# Altium project VCO_MainBoard.PrjPcb
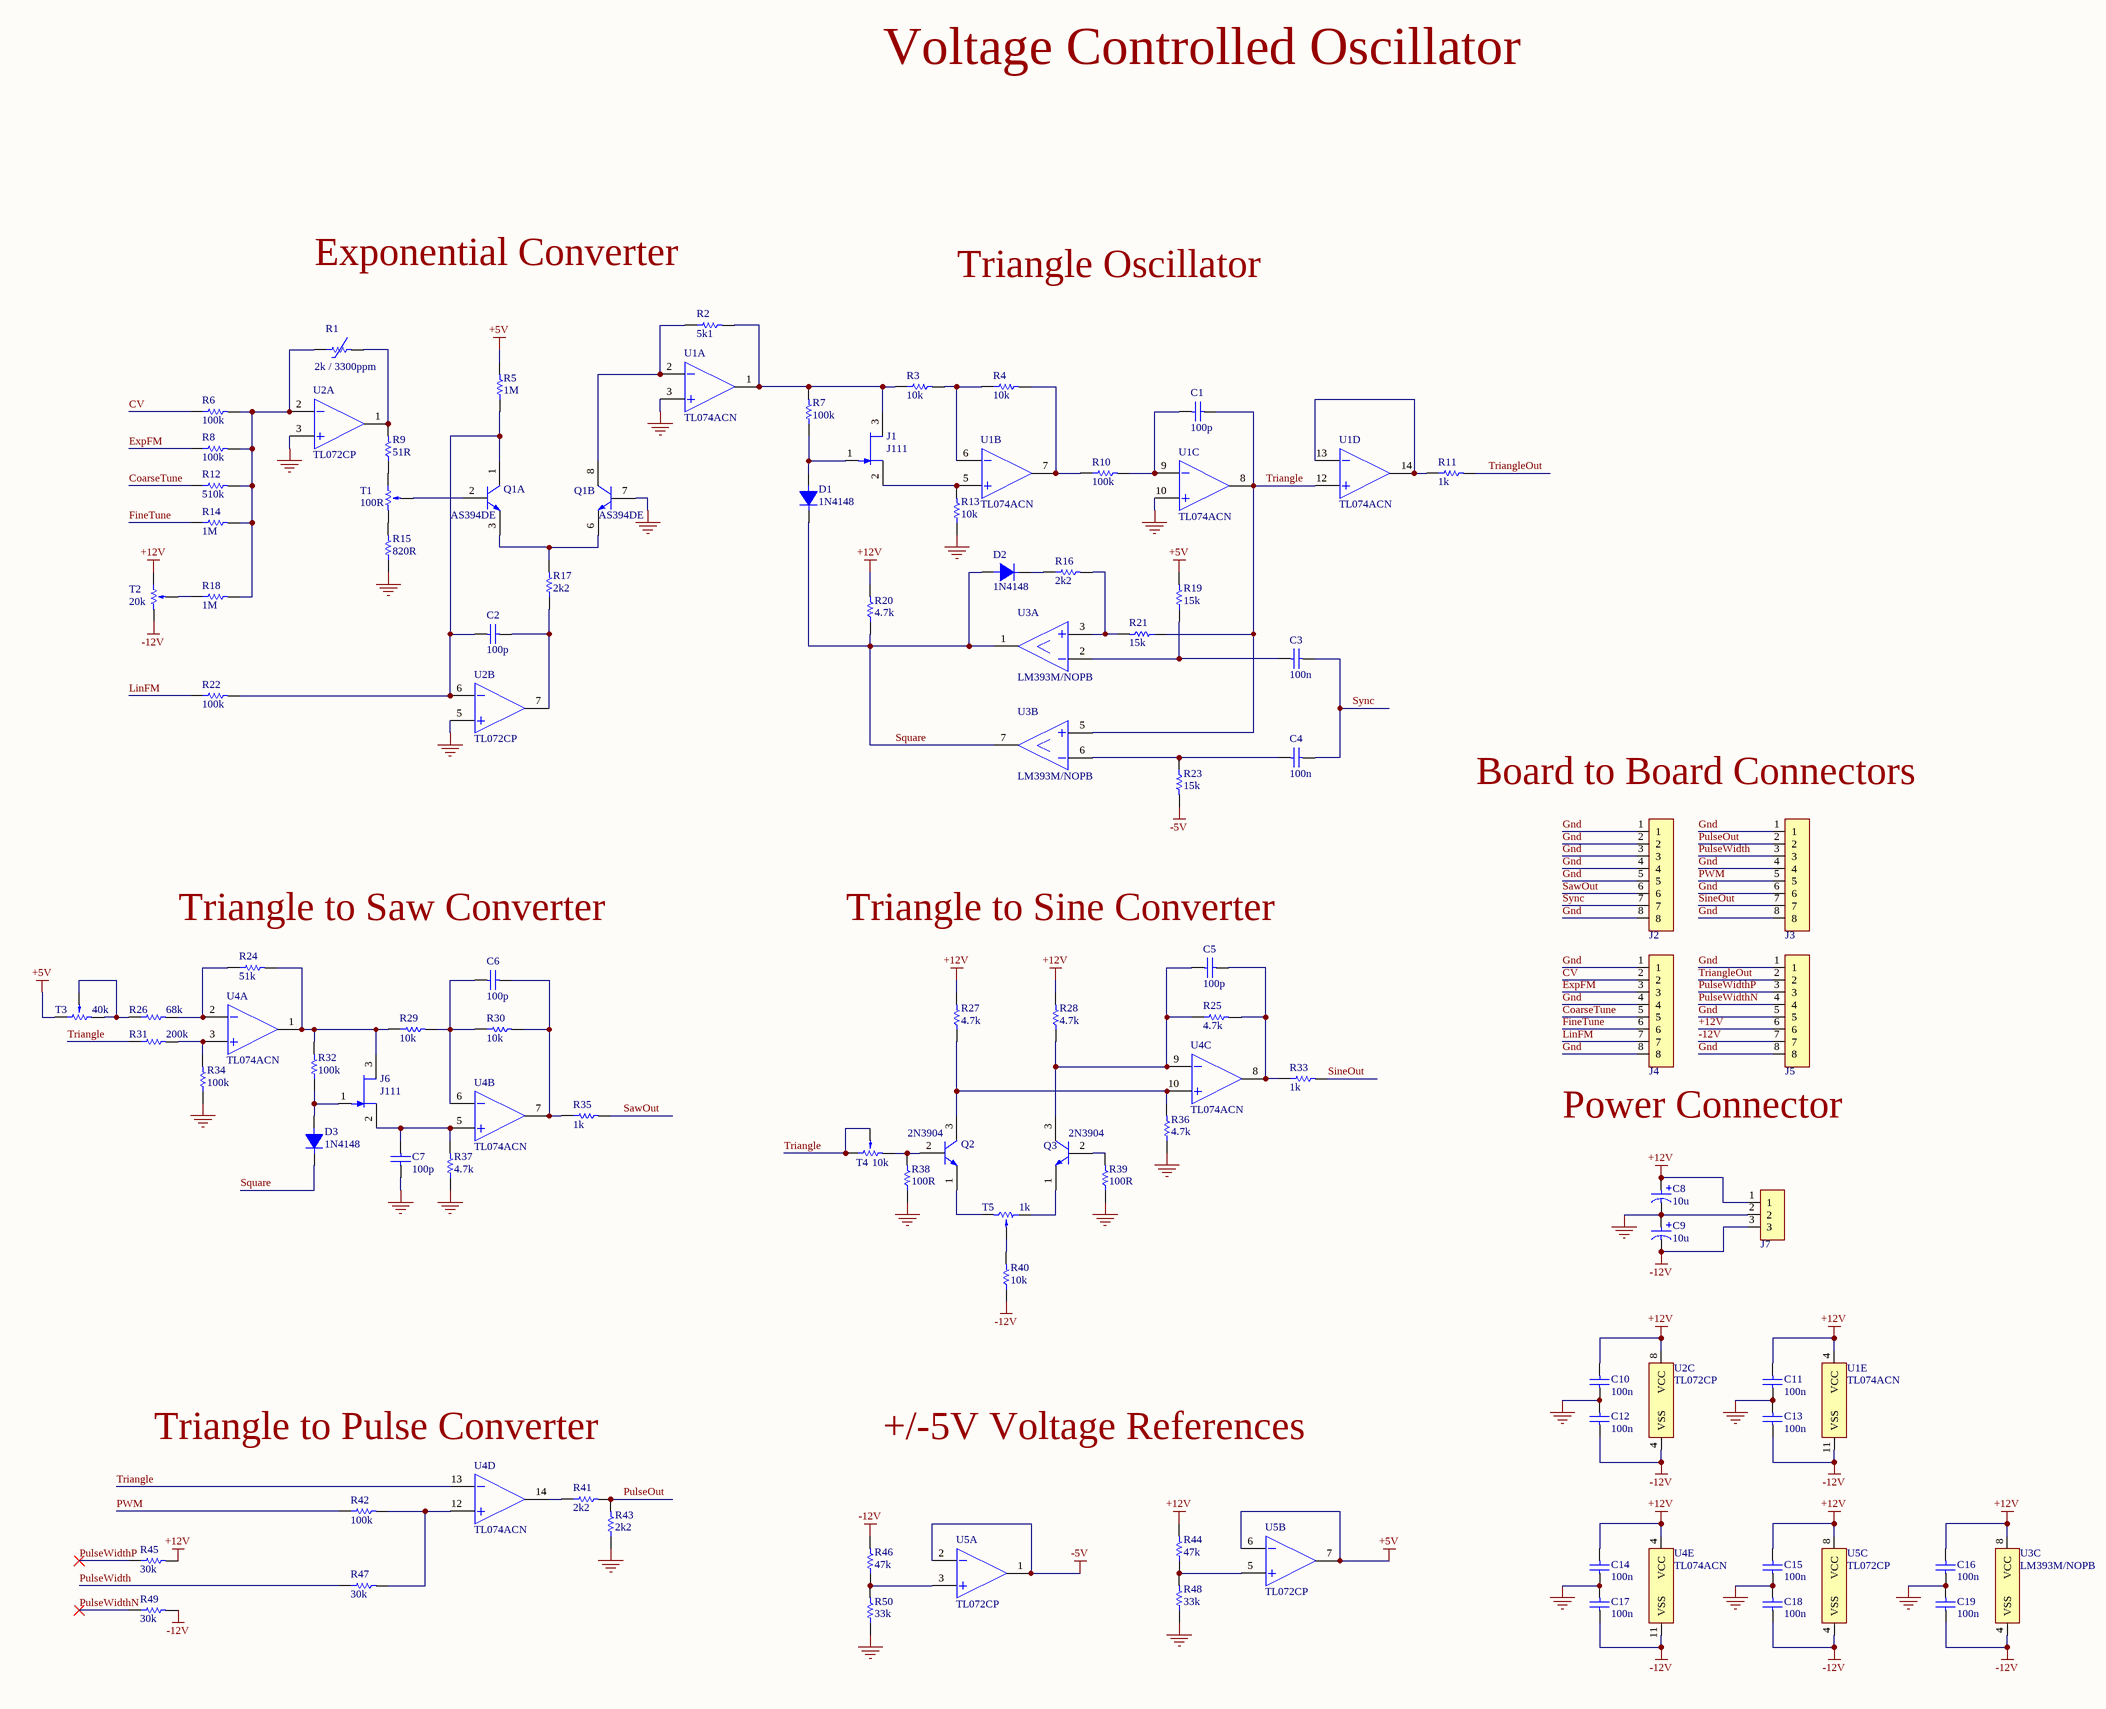
[diagram p0: VCO_MainBoard.SchDoc]
1 sheet, 92 parts. Net scope: global (net labels, ports and power ports of the same name join across sheets).
Board file: VCO_MainBoard.PcbDoc

## Sheet VCO_MainBoard.SchDoc: Voltage Controlled Oscillator - Main Board
size A2; Author: Laura Isabel Regan Williams; DrawnBy: Laura Regan Williams; SheetNumber: 1; SheetTotal: 1

### Parts
C1  100p  [CAP DISC 2.54MM PITCH 5.0 DIAMETER]
C2  100p  [CAP DISC 2.54MM PITCH 5.0 DIAMETER]
C3  100n  [CAP DISC 2.54MM PITCH 5.0 DIAMETER]
C4  100n  [CAP DISC 2.54MM PITCH 5.0 DIAMETER]
C5  100p  [CAP DISC 2.54MM PITCH 5.0 DIAMETER]
C6  100p  [CAP DISC 2.54MM PITCH 5.0 DIAMETER]
C7  100p  [CAP DISC 2.54MM PITCH 5.0 DIAMETER]
C8  10u  [CELEC_R_5x11_3]
C9  10u  [CELEC_R_5x11_3]
C10  100n  [CAP DISC 2.54MM PITCH 5.0 DIAMETER]
C11  100n  [CAP DISC 2.54MM PITCH 5.0 DIAMETER]
C12  100n  [CAP DISC 2.54MM PITCH 5.0 DIAMETER]
C13  100n  [CAP DISC 2.54MM PITCH 5.0 DIAMETER]
C14  100n  [CAP DISC 2.54MM PITCH 5.0 DIAMETER]
C15  100n  [CAP DISC 2.54MM PITCH 5.0 DIAMETER]
C16  100n  [CAP DISC 2.54MM PITCH 5.0 DIAMETER]
C17  100n  [CAP DISC 2.54MM PITCH 5.0 DIAMETER]
C18  100n  [CAP DISC 2.54MM PITCH 5.0 DIAMETER]
C19  100n  [CAP DISC 2.54MM PITCH 5.0 DIAMETER]
D1  1N4148  [SOD27]
D2  1N4148  [SOD27]
D3  1N4148  [SOD27]
J1  J111  [TO-92]
J2  HDR F 1x8 2.54MM  [HDR F 1x8 2.54MM]  (value not drawn)
J3  HDR F 1x8 2.54MM  [HDR F 1x8 2.54MM]  (value not drawn)
J4  HDR F 1x8 2.54MM  [HDR F 1x8 2.54MM]  (value not drawn)
J5  HDR F 1x8 2.54MM  [HDR F 1x8 2.54MM]  (value not drawn)
J6  J111  [TO-92]
J7  HDR M  [HDR M 1x3 2.54MM]  (value not drawn)
Q1  AS394DE  [SOIC8]  (parts A,B of 2)
Q2  2N3904  [TO-92]
Q3  2N3904  [TO-92]
R1  2k / 3300ppm  [Axial 0.125W Resistor]
R2  5k1  [Axial 0.25W Resistor]
R3  10k  [Axial 0.25W Resistor]
R4  10k  [Axial 0.25W Resistor]
R5  1M  [Axial 0.25W Resistor]
R6  100k  [Axial 0.25W Resistor]
R7  100k  [Axial 0.25W Resistor]
R8  100k  [Axial 0.25W Resistor]
R9  51R  [Axial 0.25W Resistor]
R10  100k  [Axial 0.25W Resistor]
R11  1k  [Axial 0.25W Resistor]
R12  510k  [Axial 0.25W Resistor]
R13  10k  [Axial 0.25W Resistor]
R14  1M  [Axial 0.25W Resistor]
R15  820R  [Axial 0.25W Resistor]
R16  2k2  [Axial 0.25W Resistor]
R17  2k2  [Axial 0.25W Resistor]
R18  1M  [Axial 0.25W Resistor]
R19  15k  [Axial 0.25W Resistor]
R20  4.7k  [Axial 0.25W Resistor]
R21  15k  [Axial 0.25W Resistor]
R22  100k  [Axial 0.25W Resistor]
R23  15k  [Axial 0.25W Resistor]
R24  51k  [Axial 0.25W Resistor]
R25  4.7k  [Axial 0.25W Resistor]
R26  68k  [Axial 0.25W Resistor]
R27  4.7k  [Axial 0.25W Resistor]
R28  4.7k  [Axial 0.25W Resistor]
R29  10k  [Axial 0.25W Resistor]
R30  10k  [Axial 0.25W Resistor]
R31  200k  [Axial 0.25W Resistor]
R32  100k  [Axial 0.25W Resistor]
R33  1k  [Axial 0.25W Resistor]
R34  100k  [Axial 0.25W Resistor]
R35  1k  [Axial 0.25W Resistor]
R36  4.7k  [Axial 0.25W Resistor]
R37  4.7k  [Axial 0.25W Resistor]
R38  100R  [Axial 0.25W Resistor]
R39  100R  [Axial 0.25W Resistor]
R40  10k  [Axial 0.25W Resistor]
R41  2k2  [Axial 0.25W Resistor]
R42  100k  [Axial 0.25W Resistor]
R43  2k2  [Axial 0.25W Resistor]
R44  47k  [Axial 0.25W Resistor]
R45  30k  [Axial 0.25W Resistor]
R46  47k  [Axial 0.25W Resistor]
R47  30k  [Axial 0.25W Resistor]
R48  33k  [Axial 0.25W Resistor]
R49  30k  [Axial 0.25W Resistor]
R50  33k  [Axial 0.25W Resistor]
T1  value 100R  [3296W]  (hidden comment: Trimmer)
T2  value 20k  [3296W]  (hidden comment: Trimmer)
T3  value 40k  [3296W]  (hidden comment: Trimmer)
T4  value 10k  [3296W]  (hidden comment: Trimmer)
T5  value 1k  [3296W]  (hidden comment: Trimmer)
U1  TL074ACN  [PDIP14]  (parts A,B,C,D,E of 5)
U2  TL072CP  [PDIP8]  (parts A,B,C of 3)
U3  LM393M/NOPB  [PDIP8]  (parts A,B,C of 3)
U4  TL074ACN  [PDIP14]  (parts A,B,C,D,E of 5)
U5  TL072CP  [PDIP8]  (parts A,B,C of 3)

### Nets
+5V: R5.2 R19.2 T3.1 U5.6 U5.7
+12V: C8.2 C10.2 C11.2 C14.2 C15.2 C16.2 J5.6 J7.1 R20.2 R27.2 R28.2 R44.2 R45.2 T2.1 U1.4(VCC) U2.8(VCC) U3.8(VCC) U4.4(VCC) U5.8(VCC)
-5V: R23.2 U5.1 U5.2
-12V: C9.1 C12.1 C13.1 C17.1 C18.1 C19.1 J5.7 J7.3 R40.1 R46.2 R49.2 T2.3 U1.11(VSS) U2.4(VSS) U3.4(VSS) U4.11(VSS) U5.4(VSS)
Gnd: C7.2 C8.1 C9.2 C10.1 C11.1 C12.2 C13.2 C14.1 C15.1 C16.1 C17.2 C18.2 C19.2 J2.1 J2.2 J2.3 J2.4 J2.5 J2.8 J3.1 J3.4 J3.6 J3.8 J4.1 J4.4 J4.8 J5.1 J5.5 J5.8 J7.2 Q1.7 R13.1 R15.1 R34.1 R36.1 R37.1 R38.1 R39.1 R43.1 R48.1 R50.1 U1.3 U1.10 U2.3 U2.5
CoarseTune: J4.5 R12.1
CV: J4.2 R6.1
ExpFM: J4.3 R8.1
FineTune: J4.6 R14.1
LinFM: J4.7 R22.1
PulseOut: J3.2 R41.2 R43.2
PulseWidth: J3.3 R47.1
PulseWidthN: J5.4 R49.1
PulseWidthP: J5.3 R45.1
PWM: J3.5 R42.1
SawOut: J2.6 R35.2
SineOut: J3.7 R33.2
Square: D1.2 D2.1 D3.2 R20.1 U3.1 U3.7
Sync: C3.1 C4.1 J2.7
Triangle: C1.2 R21.1 R31.1 T4.1 T4.2 U1.8 U1.12 U3.5 U4.13
TriangleOut: J5.2 R11.2
NetC1_1: C1.1 R10.2 U1.9
NetC2_1: C2.1 R17.1 U2.7
NetC2_2: C2.2 Q1.1 R5.1 R22.2 U2.6
NetC3_2: C3.2 R19.1 U3.2
NetC4_2: C4.2 R23.1 U3.6
NetC5_1: C5.1 R25.2 R33.1 U4.8
NetC5_2: C5.2 Q3.3 R25.1 R28.1 U4.9
NetC6_1: C6.1 R30.2 R35.1 U4.7
NetC6_2: C6.2 R29.2 R30.1 U4.6
NetC7_1: C7.1 J6.2 R37.2 U4.5
NetD1_1: D1.1 J1.1 R7.1
NetD2_2: D2.2 R16.1
NetD3_1: D3.1 J6.1 R32.1
NetJ1_2: J1.2 R13.2 U1.5
NetJ1_3: J1.3 R2.2 R3.1 R7.2 U1.1
NetJ6_3: J6.3 R24.2 R29.1 R32.2 U4.1
NetQ1_2: Q1.2 T1.2
NetQ1_3: Q1.3 Q1.6 R17.2
NetQ1_8: Q1.8 R2.1 U1.2
NetQ2_1: Q2.1 T5.3
NetQ2_2: Q2.2 R38.2 T4.3
NetQ2_3: Q2.3 R27.1 R36.2 U4.10
NetQ3_1: Q3.1 T5.1
NetQ3_2: Q3.2 R39.2
NetR1_1: R1.1 R6.2 R8.2 R12.2 R14.2 R18.2 U2.2
NetR1_2: R1.2 R9.2 U2.1
NetR3_2: R3.2 R4.1 U1.6
NetR4_2: R4.2 R10.1 U1.7
NetR9_1: R9.1 T1.1
NetR11_1: R11.1 U1.13 U1.14
NetR15_2: R15.2 T1.3
NetR16_2: R16.2 R21.2 U3.3
NetR18_1: R18.1 T2.2
NetR24_1: R24.1 R26.2 U4.2
NetR26_1: R26.1 T3.2 T3.3
NetR31_2: R31.2 R34.2 U4.3
NetR40_2: R40.2 T5.2
NetR41_1: R41.1 U4.14
NetR42_2: R42.2 R47.2 U4.12
NetR44_1: R44.1 R48.2 U5.5
NetR46_1: R46.1 R50.2 U5.3

### Notes on the sheet
- Voltage Controlled Oscillator
- Exponential Converter
- Triangle Oscillator
- Board to Board Connectors
- Triangle to Saw Converter
- (near C5) Triangle to Sine Converter
- Power Connector
- Triangle to Pulse Converter
- +/-5V Voltage References

### Library data of the parts
C1 C2 C5-C7 = CDC-101
C3 C4 C10-C19 = CDC-104
C8 C9 = CELEC-106: Radial Electrolytic Capacitor
J7 = HDR M 1x3 2.54MM
R1 = LT16S202F33
R2 = ACR-0025-1-5K1: Axial Carbon Film Resistor
R3 R4 R13 R29 R30 R40 = ACR-0025-1-10K: Axial Carbon Film Resistor
R5 R14 R18 = ACR-0025-1-1M: Axial Carbon Film Resistor
R6-R8 R10 R22 R32 R34 R42 = ACR-0025-1-100K: Axial Carbon Film Resistor
R9 = ACR-0025-1-51R: Axial Carbon Film Resistor
R11 R33 R35 = ACR-0025-1-1K: Axial Carbon Film Resistor
R12 = ACR-0025-1-510K: Axial Carbon Film Resistor
R15 = ACR-0025-1-820R: Axial Carbon Film Resistor
R16 R17 R41 R43 = ACR-0025-1-2k2: Axial Carbon Film Resistor
R19 R21 R23 = ACR-0025-1-15K: Axial Carbon Film Resistor
R20 R25 R27 R28 R36 R37 = ACR-0025-1-4K7: Axial Carbon Film Resistor
R24 = ACR-0025-1-51K: Axial Carbon Film Resistor
R26 = ACR-0025-1-68K: Axial Carbon Film Resistor
R31 = ACR-0025-1-200K: Axial Carbon Film Resistor
R38 R39 = ACR-0025-1-100R: Axial Carbon Film Resistor
R44 R46 = ACR-0025-1-47K: Axial Carbon Film Resistor
R45 R47 R49 = ACR-0025-1-30K: Axial Carbon Film Resistor
R48 R50 = ACR-0025-1-33K: Axial Carbon Film Resistor
T1-T5 = Trimmer: SET: 0.5
U1 U4 = TL074ACN: Operational Amplifiers - Op Amps Quad Low Noise JFET; Manufacturer: Texas Instruments; Number of Circuits: 4; Gain Bandwidth Product: 3MHz; Operating Supply Voltage: 18V; Nominal Supply Current: 10mA; Voltage Gain: 106.02dB; Min Dual Supply Voltage: 3.5V; Common Mode Rejection Ratio: 75dB; Slew Rate: 13V/µs; Input Bias Current: 200pA; Input Offset Voltage (Vos): 6mV; Operating Supply Current: 1.4mA; Dual Supply Voltage: 9V; Supplier 1: RSComponents; Manufacturer Part Number: TL074ACN; RoHS: Yes; Category: Amplifiers - Op Amps, Buffer, Instrumentation; Stock 1: 477; Pricing 1: 1=1.20500, 2=1.13600, 5=1.08200, 10=1.01300 (USD); Case/Package: N; Number of Pins: 14; Min Operating Temperature: 0°C; Max Operating Temperature: 70°C; Packaging: Rail/Tube; Bandwidth: 3MHz; Max Dual Supply Voltage: 18V; Package Quantity: 25; Number of Channels: 4; Nominal Gain Bandwidth Product: 3MHz; Max I/O Voltage: 6mV; Unity Gain Bandwidth Product: 3MHz; Number of Elements: 4; Number of Amplifiers: 4; Length: 19.3mm; Width: 6.35mm; Height: 4.57mm; Radiation Hardening: No; Lead Free: Lead Free; RoHS Compliant: Yes; REACH SVHC: No SVHC; ComponentLink1URL: https://datasheet.ciiva.com/23801/tl072-23801536.pdf?src-supplier=Newark; ComponentLink1Description: https://datasheet.ciiva.com/23801/tl072-23801536.pdf?src-supplier=Newark; ComponentLink2URL: https://datasheet.ciiva.com/15129/getdatasheetpartid-30262-15129616.pdf?src-supplier=Verical; ComponentLink2Description: https://datasheet.ciiva.com/15129/getdatasheetpartid-30262-15129616.pdf?src-supplier=Verical; ComponentLink3URL: https://datasheet.ciiva.com/1797/tl071a-1797486.pdf?src-supplier=Digi-Key; ComponentLink3Description: https://datasheet.ciiva.com/1797/tl071a-1797486.pdf?src-supplier=Digi-Key; ComponentLink4URL: https://datasheet.ciiva.com/26244/tl074-26244101.pdf?src-supplier=Avnet+Europe; ComponentLink4Description: https://datasheet.ciiva.com/26244/tl074-26244101.pdf?src-supplier=Avnet+Europe; ComponentLink5URL: https://datasheet.ciiva.com/2974/tl074-2974215.pdf?src-supplier=Avnet; ComponentLink5Description: https://datasheet.ciiva.com/2974/tl074-2974215.pdf?src-supplier=Avnet; ComponentLink6URL: https://datasheet.ciiva.com/14151/nstl071-to-tl074-e-14151144.pdf?src-supplier=Distrelec; ComponentLink6Description: https://datasheet.ciiva.com/14151/nstl071-to-tl074-e-14151144.pdf?src-supplier=Distrelec; Supplier Part Number 1: 1822441
U2 U5 = TL072CP: IC, OP AMP, DUAL JFET, DIP8; Bandwidth:3MHz; No. of Amplifiers:2; Slew Rate:13V/ s; Supply Voltage Range:7V to 36V; Amplifier Case Style:DIP; No. of Pins:8; Operating Temperature Min:0 C; Operating Temperature Max:70 C; ;RoHS Compliant: Yes; Manufacturer: Texas Instruments; Number of Circuits: 2; Gain Bandwidth Product: 3MHz; Slew Rate: 13V/µs; Input Bias Current: 200pA; Input Offset Voltage (Vos): 3mV; Operating Supply Current: 1.4mA; Voltage Gain: 106.02dB; Nominal Supply Current: 5mA; Max Dual Supply Voltage: 18V; Min Dual Supply Voltage: 3.5V; Common Mode Rejection Ratio: 70dB; Max I/O Voltage: 10mV; Dual Supply Voltage: 9V; Supplier 1: RSComponents; Manufacturer Part Number: TL072CP; RoHS: Yes; Category: Amplifiers - Op Amps, Buffer, Instrumentation; Stock 1: 796; Pricing 1: 1=1.09500, 5=0.98600, 10=0.87600, 15=0.82100, 25=0.76700 (USD); Case/Package: P; Number of Pins: 8; Contact Plating: Gold; Min Operating Temperature: -40°C; Max Operating Temperature: 85°C; Packaging: Rail/Tube; Bandwidth: 3MHz; Number of Channels: 2; Package Quantity: 50; Nominal Gain Bandwidth Product: 3MHz; Unity Gain Bandwidth Product: 3MHz; Number of Elements: 2; Max Supply Voltage: 18V; Number of Amplifiers: 2; Length: 9.81mm; Width: 6.35mm; Height: 4.57mm; Radiation Hardening: No; Lead Free: Lead Free; RoHS Compliant: Yes; REACH SVHC: No SVHC; ComponentLink1URL: https://datasheet.ciiva.com/7709/1764387-7709920.pdf?src-supplier=Element14; ComponentLink1Description: https://datasheet.ciiva.com/7709/1764387-7709920.pdf?src-supplier=Element14; ComponentLink2URL: https://datasheet.ciiva.com/1796/tl071a-1796082.pdf?src-supplier=Digi-Key; ComponentLink2Description: https://datasheet.ciiva.com/1796/tl071a-1796082.pdf?src-supplier=Digi-Key; ComponentLink3URL: https://datasheet.ciiva.com/26243/tl074-26243621.pdf?src-supplier=Avnet+Europe; ComponentLink3Description: https://datasheet.ciiva.com/26243/tl074-26243621.pdf?src-supplier=Avnet+Europe; ComponentLink4URL: https://datasheet.ciiva.com/2974/tl074-2974205.pdf?src-supplier=Avnet; ComponentLink4Description: https://datasheet.ciiva.com/2974/tl074-2974205.pdf?src-supplier=Avnet; Supplier Part Number 1: 0304239
U3 = LM393M/NOPB: IC COMP DUAL LO PWR 8-SOIC; Manufacturer: TI National Semiconductor; Nominal Supply Current: 1mA; Output Current: 16mA; Number of Channels: 2; Response Time: 1.3us; Quiescent Current: 2.5mA; Max Supply Voltage: 36V; Min Supply Voltage: 2V; Voltage Gain: 106.02dB; Min Dual Supply Voltage: 1V; Max Dual Supply Voltage: 18V; Max Supply Current: 200uA; Input Bias Current: 250nA; Input Offset Voltage (Vos): 5mV; Output Type: TTL; Dual Supply Voltage: 9V; Operating Supply Voltage: 28V; Max Power Dissipation: 510mW; Propagation Delay: 700ns; Turn-On Delay Time: 0.4us; Output Compatibility: CMOS; Supplier 1: RSComponents; Manufacturer Part Number: LM393M/NOPB; RoHS: Yes; Category: Amplifiers - Op Amps, Buffer, Instrumentation; Stock 1: 691; Pricing 1: 1=0.95800, 5=0.86200, 10=0.76700, 25=0.72600, 50=0.67100 (USD); Mount: Surface Mount; Case/Package: SOIC; Number of Pins: 8; Min Operating Temperature: 0°C; Max Operating Temperature: 70°C; Packaging: Rail/Tube; Number of Elements: 2; Package Quantity: 95; Supply Current: 1mA; Series: -; Technology: BIPOLAR; Max Input Current: 250nA; Power Dissipation: 510mW; Type: General Purpose; Termination: SMD/SMT; Length: 4.9mm; Width: 3.9mm; Height: 1.45mm; Radiation Hardening: No; Lead Free: Lead Free; RoHS Compliant: Yes; REACH SVHC: No SVHC; ComponentLink1URL: https://datasheet.ciiva.com/1483/1837571-1483072.pdf?src-supplier=Element14; ComponentLink1Description: https://datasheet.ciiva.com/1483/1837571-1483072.pdf?src-supplier=Element14; ComponentLink2URL: https://datasheet.ciiva.com/19456/901191-19456110.pdf?src-supplier=Jameco; ComponentLink2Description: https://datasheet.ciiva.com/19456/901191-19456110.pdf?src-supplier=Jameco; ComponentLink3URL: https://datasheet.ciiva.com/15130/getdatasheetpartid-141687-15130895.pdf?src-supplier=Verical; ComponentLink3Description: https://datasheet.ciiva.com/15130/getdatasheetpartid-141687-15130895.pdf?src-supplier=Verical; ComponentLink4URL: https://datasheet.ciiva.com/16464/lm193-n-16464325.pdf?src-supplier=Avnet+Asia; ComponentLink4Description: https://datasheet.ciiva.com/16464/lm193-n-16464325.pdf?src-supplier=Avnet+Asia; ComponentLink5URL: https://datasheet.ciiva.com/14153/oilmx93-2903-dat-e-14153111.pdf?src-supplier=Distrelec; ComponentLink5Description: https://datasheet.ciiva.com/14153/oilmx93-2903-dat-e-14153111.pdf?src-supplier=Distrelec; ComponentLink6URL: https://datasheet.ciiva.com/6625/lm193-n-6625114.pdf?src-supplier=Digi-Key; ComponentLink6Description: https://datasheet.ciiva.com/6625/lm193-n-6625114.pdf?src-supplier=Digi-Key; ComponentLink7URL: https://datasheet.ciiva.com/2970/lm193-n-2970524.pdf?src-supplier=Avnet; ComponentLink7Description: https://datasheet.ciiva.com/2970/lm193-n-2970524.pdf?src-supplier=Avnet; Supplier Part Number 1: 5361388